# Altium schematic sheet 智能车主板.SchDoc
size A1
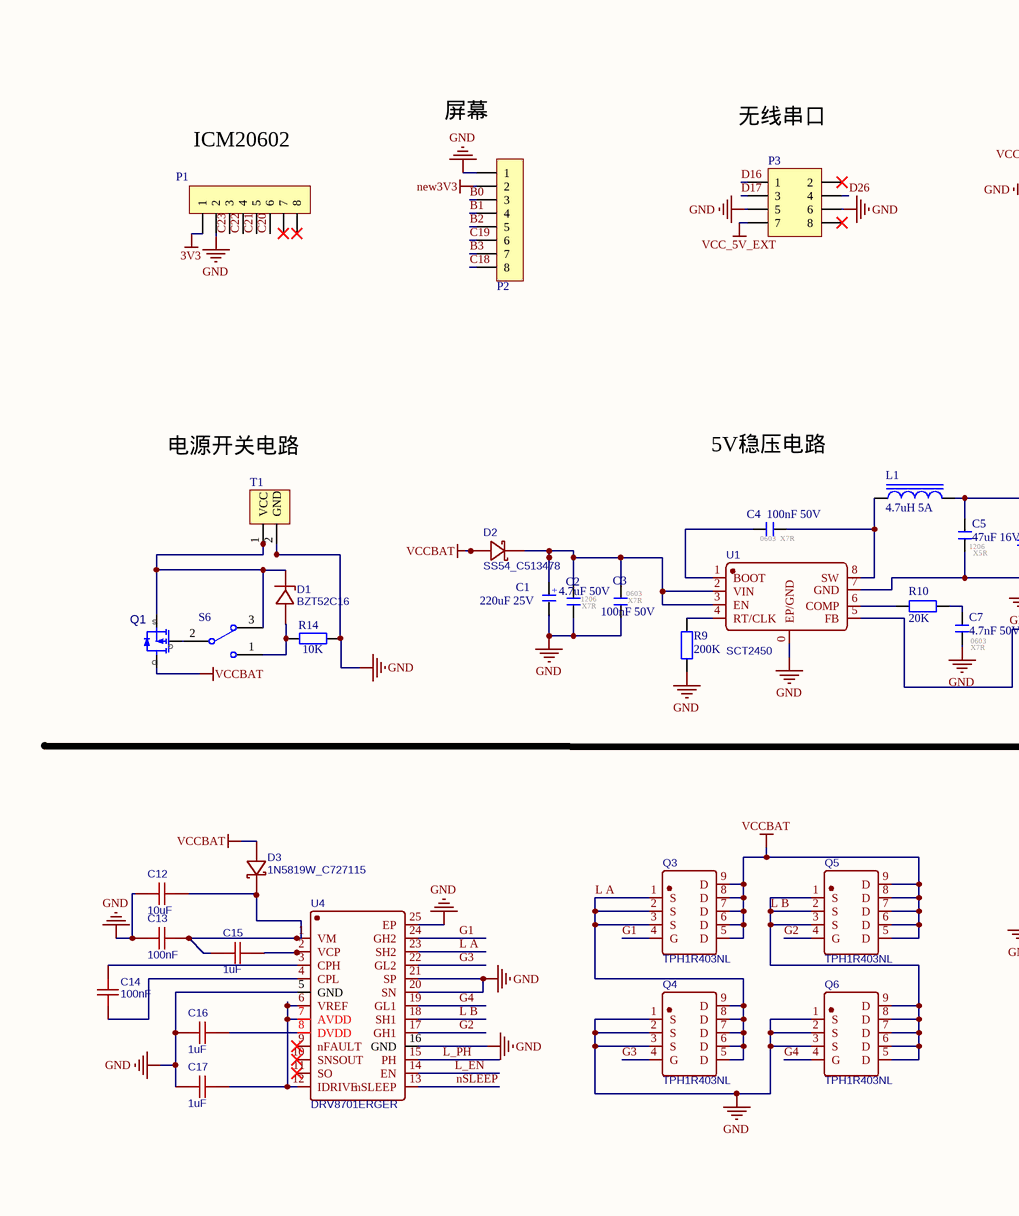
[diagram p0: 智能车主板.SchDoc, top left]
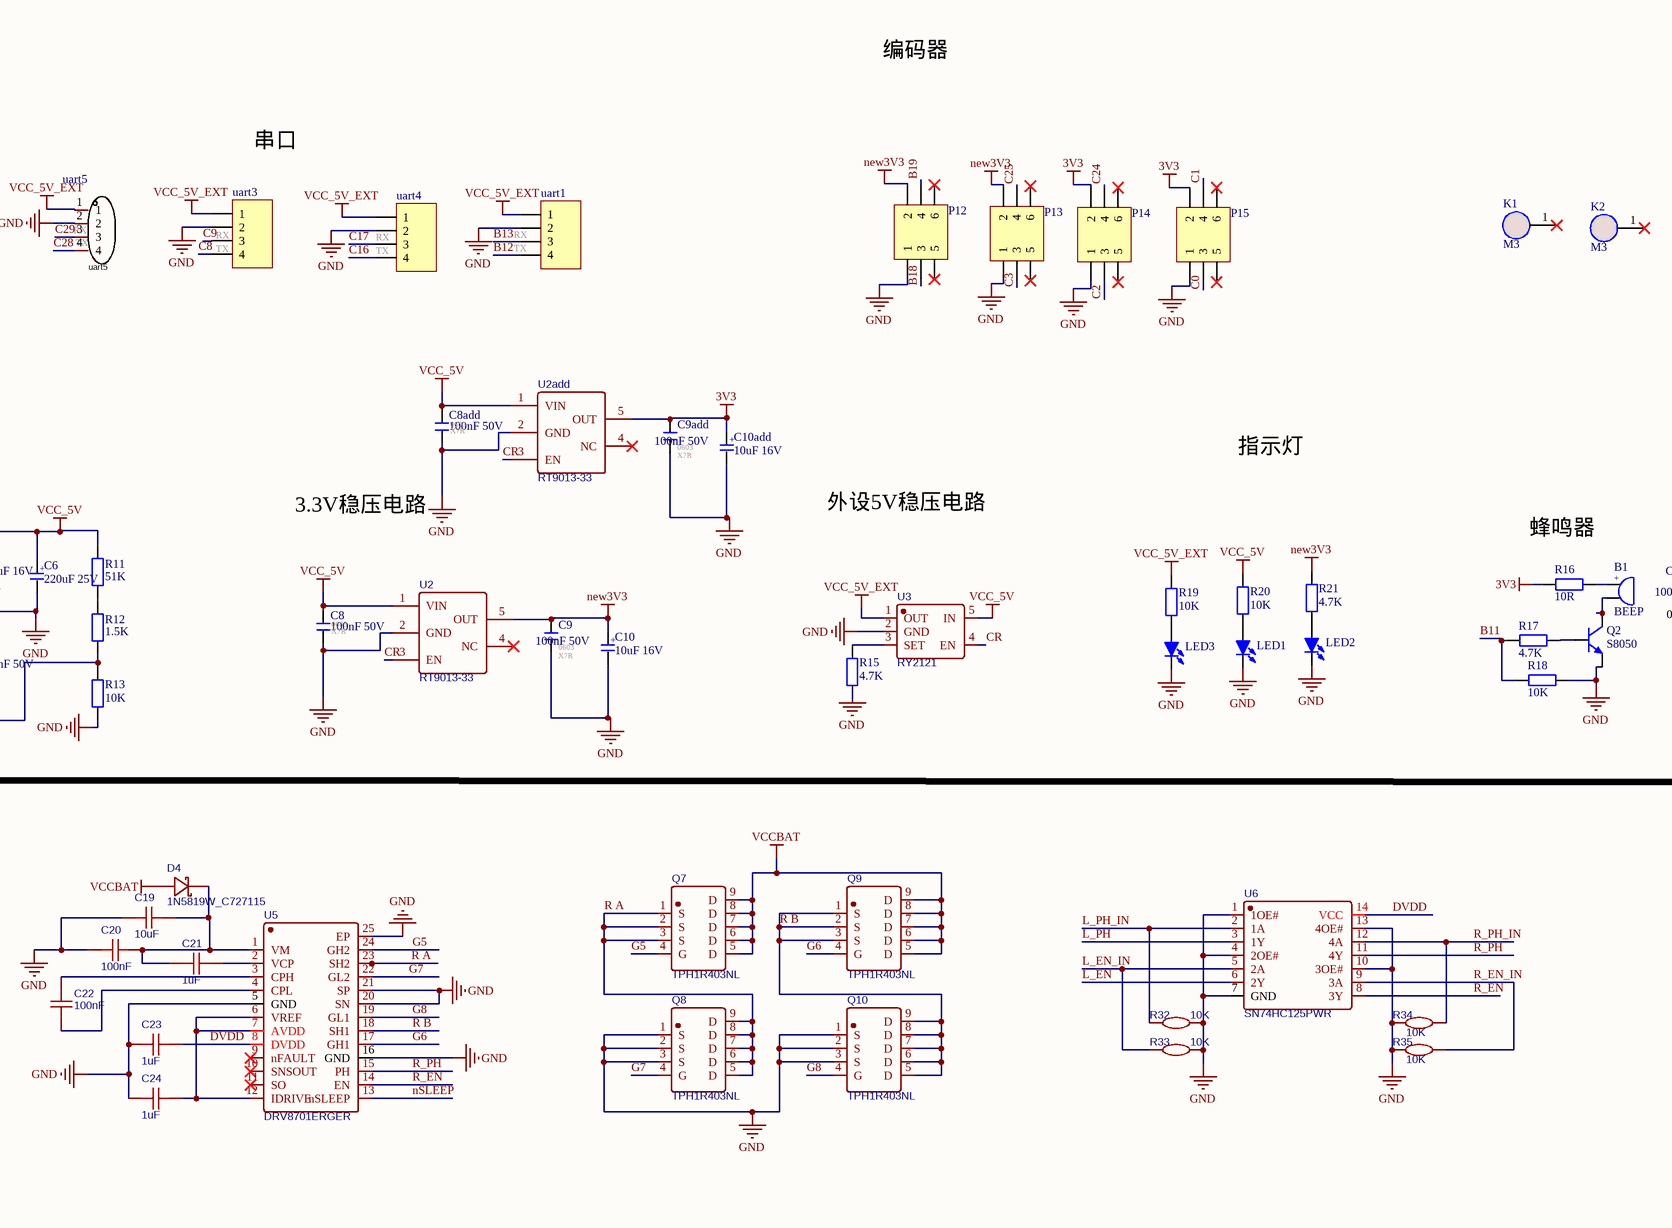
[diagram p1: 智能车主板.SchDoc, top middle]
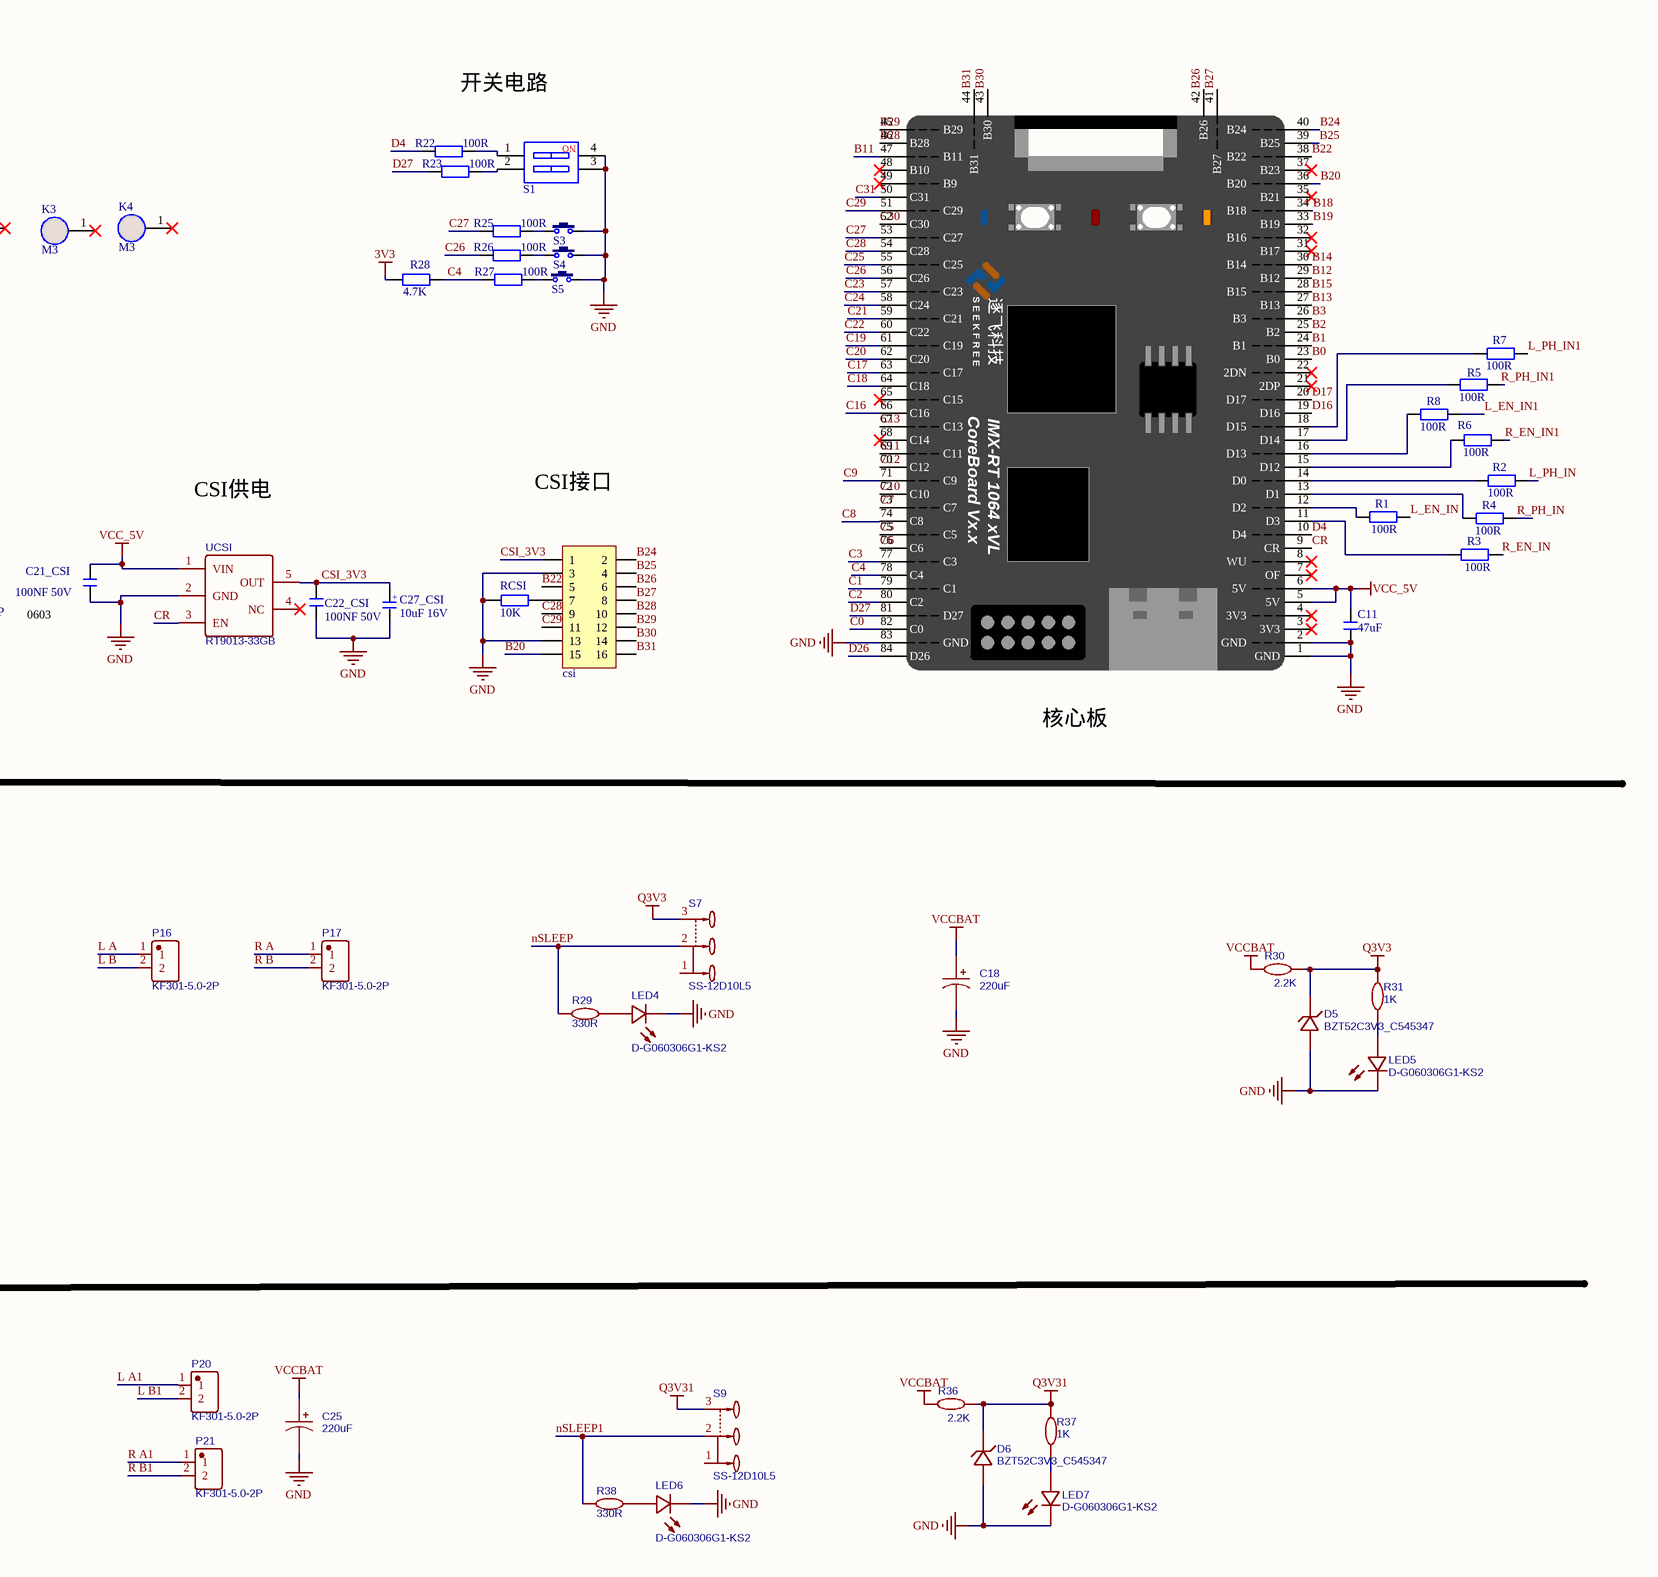
[diagram p2: 智能车主板.SchDoc, top right]
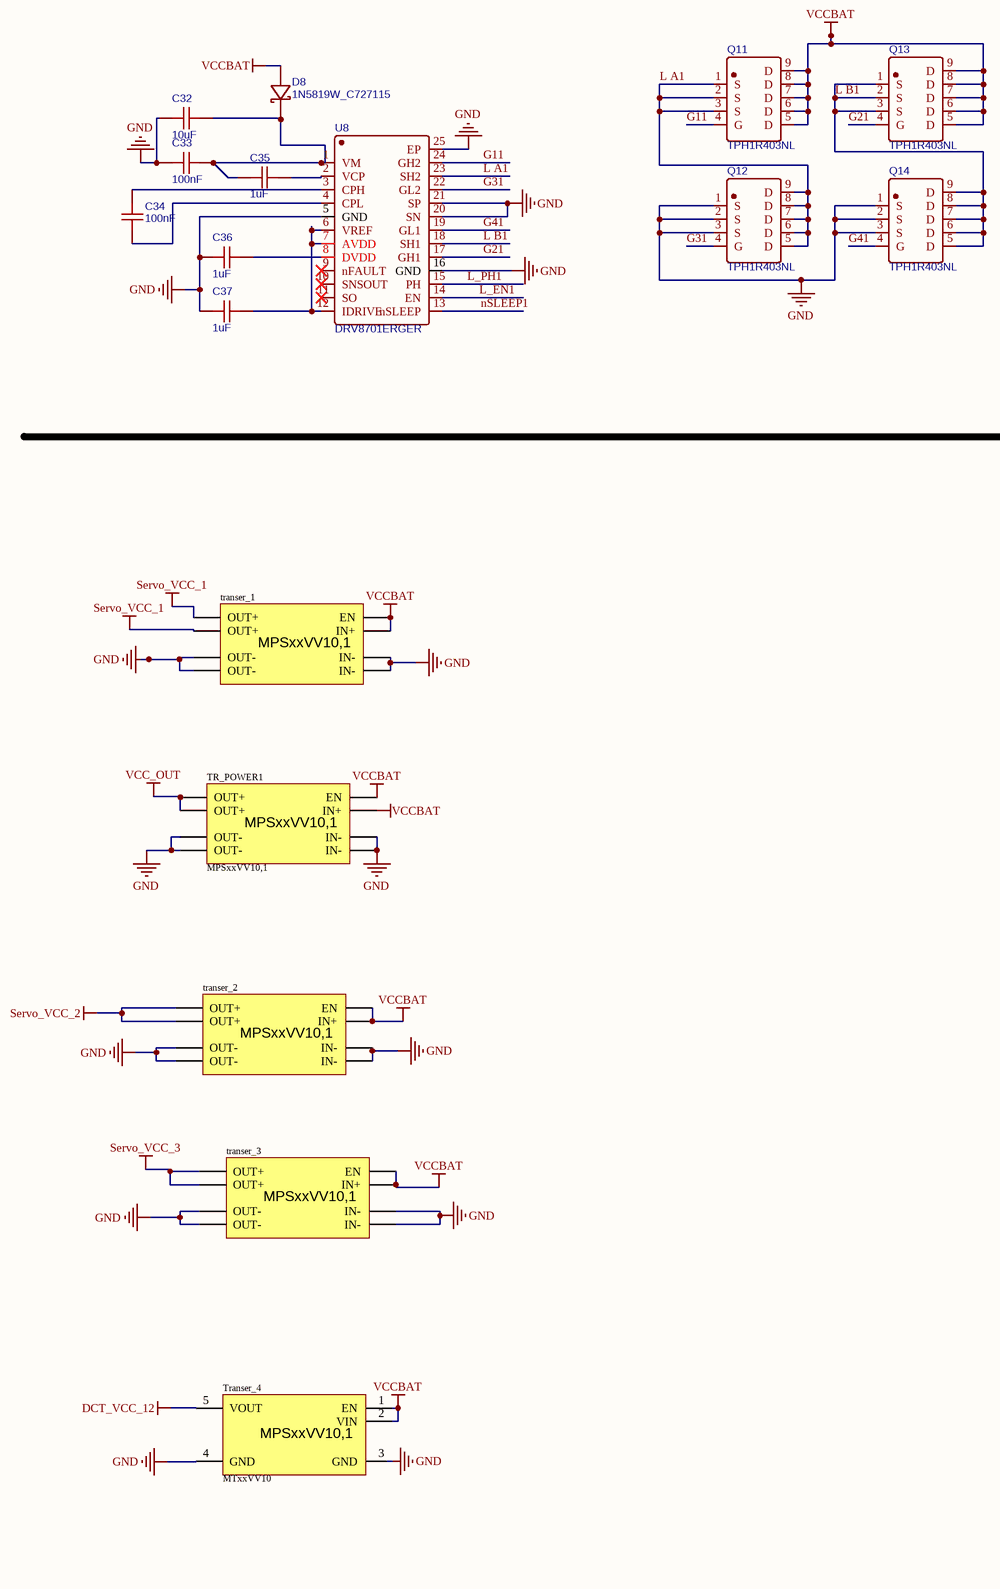
[diagram p3: 智能车主板.SchDoc, bottom left]
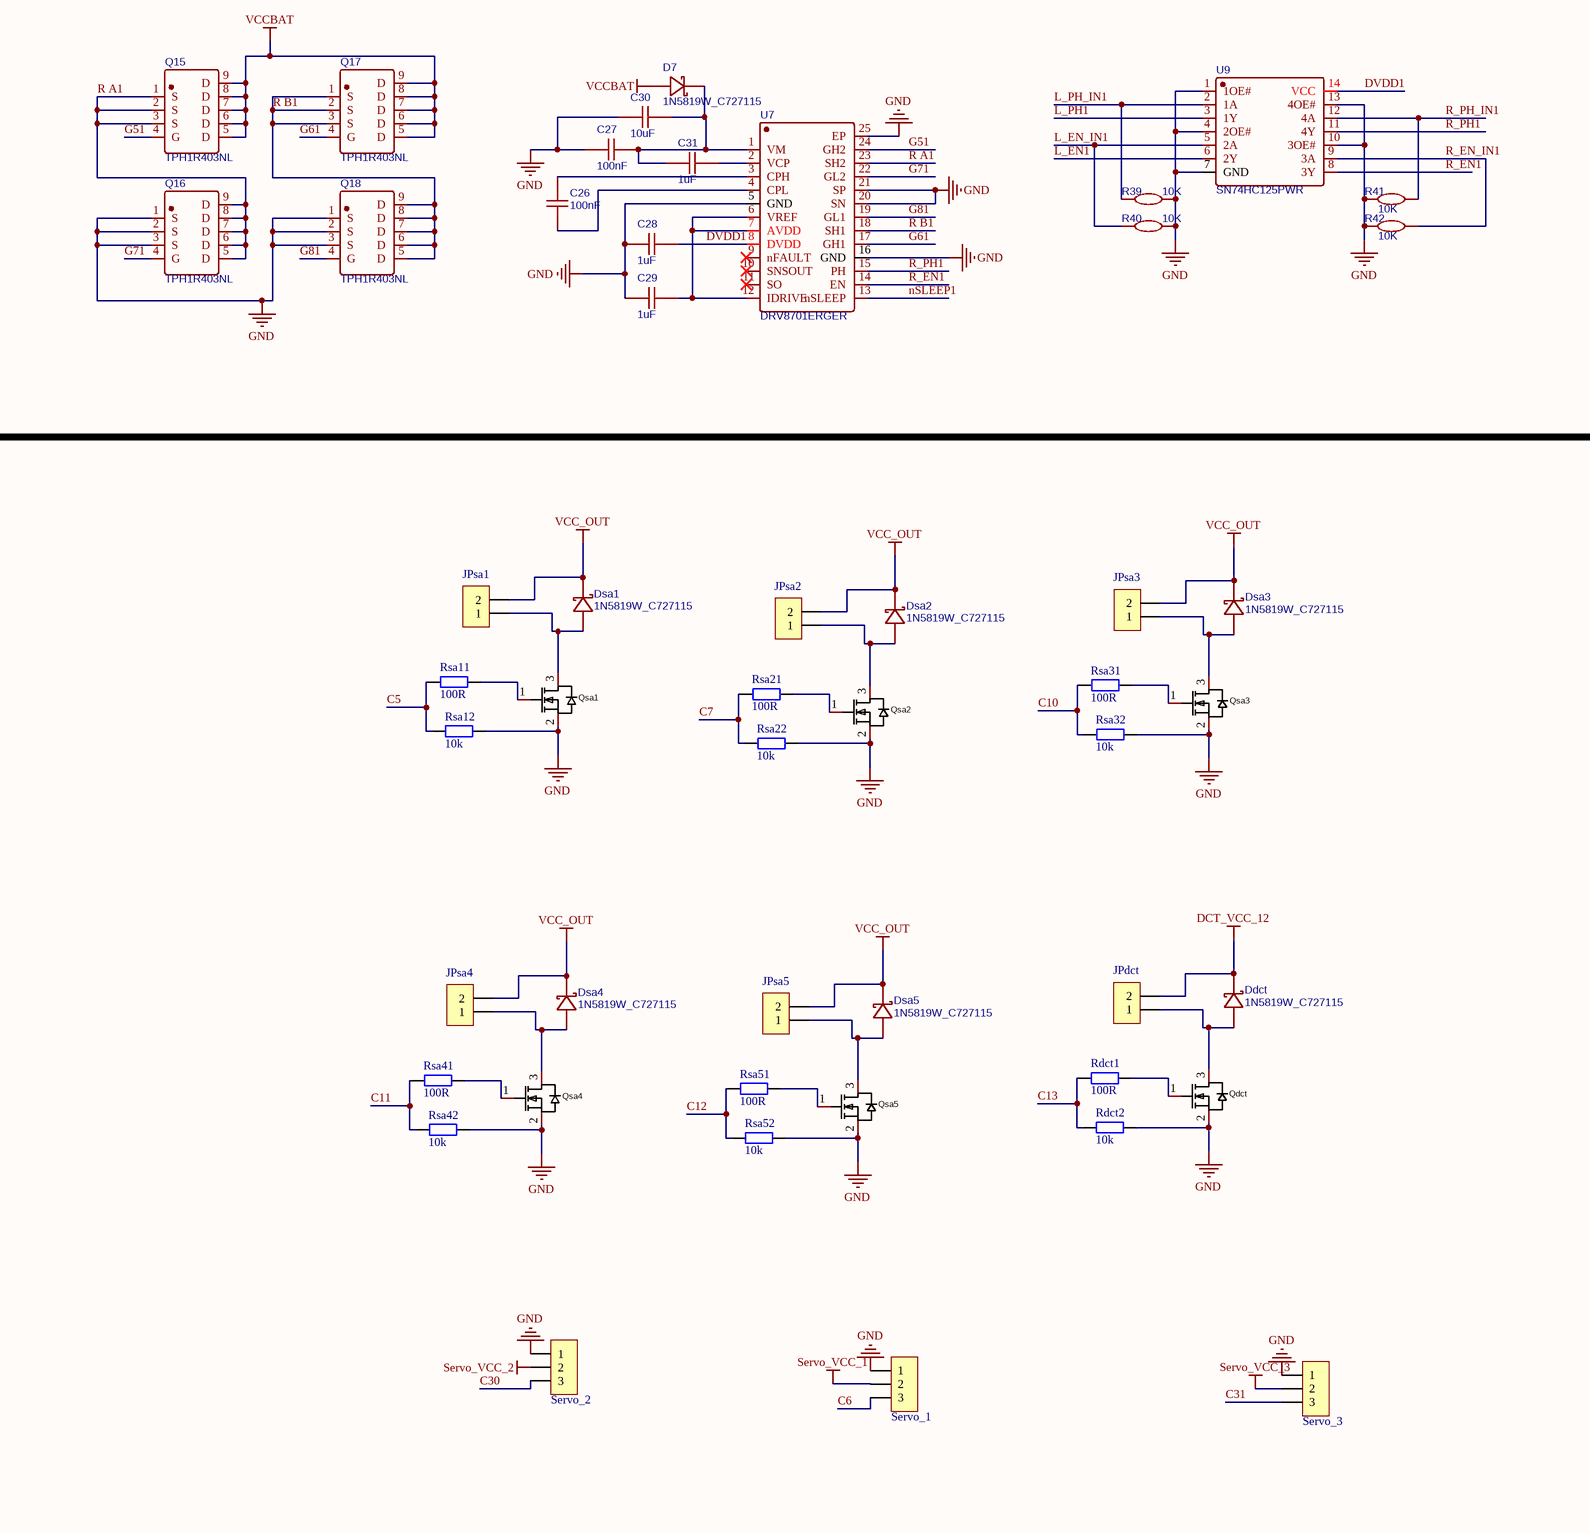
[diagram p4: 智能车主板.SchDoc, bottom middle]
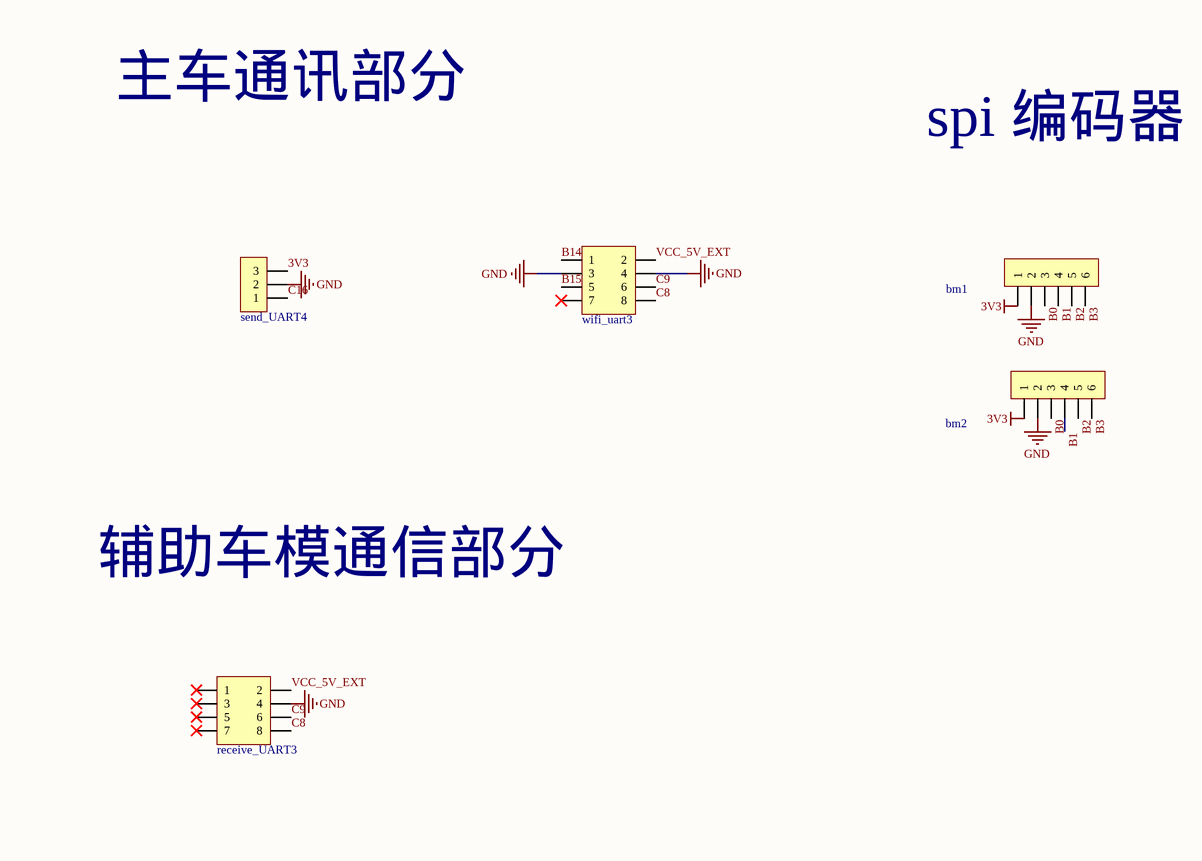
[diagram p5: 智能车主板.SchDoc, bottom right]

## Parts
B1  BEEP  [蜂鸣器]
bm1  HDR-1X6  [HDR1X6]  (value not drawn)
bm2  HDR-1X6  [HDR1X6]  (value not drawn)
C1  220uF 25V  [22uf25v贴片铝水解电容（6.3，7.7）]
C2  4.7uF 50V  [1206C]
C3  100nF 50V  [0603R]
C4  100nF 50V  [0603R]
C5  47uF 16V  [1206C]
C6  220uF 25V  [22uf25v贴片铝水解电容（6.3，7.7）]
C7  4.7nF 50V  [0603R]
C8  100nF 50V  [0603R]
C8add  100nF 50V  [0603R]
C9  100nF 50V  [0603R]
C9add  100nF 50V  [0603R]
C10  10uF 16V  [CASE-A-3216  钽电容]
C10add  10uF 16V  [CASE-A-3216  钽电容]
C11  47uF  [1206C]
C12  10uF  [0603R]
C13  100nF  [C0603]
C14  100nF  [C0603]
C15  1uF  [C0603]
C16  1uF  [C0603]
C17  1uF  [C0603]
C18  220uF  [22uf25v贴片铝水解电容（6.3，7.7）]
C19  10uF  [0603R]
C20  100nF  [C0603]
C21  1uF  [C0603]
C21_CSI  100NF 50V  [C0603]
C22  100nF  [C0603]
C22_CSI  100NF 50V  [C0603]
C23  1uF  [C0603]
C24  1uF  [C0603]
C25  220uF  [22uf25v贴片铝水解电容（6.3，7.7）]
C26  100nF  [C0603]
C27  100nF  [C0603]
C27_CSI  10uF 16V  [CASE-A-3216  钽电容]
C28  1uF  [C0603]
C29  1uF  [C0603]
C30  10uF  [0603R]
C31  1uF  [C0603]
C32  10uF  [0603R]
C33  100nF  [C0603]
C34  100nF  [C0603]
C35  1uF  [C0603]
C36  1uF  [C0603]
C37  1uF  [C0603]
csi  Header 8X2  [HDR2X8]  (value not drawn)
D1  BZT52C16  [SOD-123]
D2  SS54_C513478  [SMA（SS54）]
D3  1N5819W_C727115  [1N5819W_C727115]
D4  1N5819W_C727115  [1N5819W_C727115]
D5  BZT52C3V3_C545347  [SOD-123_L2.7-W1.6-LS3.7-RD]
D6  BZT52C3V3_C545347  [SOD-123_L2.7-W1.6-LS3.7-RD]
D7  1N5819W_C727115  [1N5819W_C727115]
D8  1N5819W_C727115  [1N5819W_C727115]
Ddct  1N5819W_C727115  [1N5819W_C727115]
Dsa1  1N5819W_C727115  [1N5819W_C727115]
Dsa2  1N5819W_C727115  [1N5819W_C727115]
Dsa3  1N5819W_C727115  [1N5819W_C727115]
Dsa4  1N5819W_C727115  [1N5819W_C727115]
Dsa5  1N5819W_C727115  [1N5819W_C727115]
JPdct  HDR-1X2  [HDR-2P]  (value not drawn)
JPsa1  HDR-1X2  [HDR-2P]  (value not drawn)
JPsa2  HDR-1X2  [HDR-2P]  (value not drawn)
JPsa3  HDR-1X2  [HDR-2P]  (value not drawn)
JPsa4  HDR-1X2  [HDR-2P]  (value not drawn)
JPsa5  HDR-1X2  [HDR-2P]  (value not drawn)
K1  M3  [固定孔M3]
K2  M3  [固定孔M3]
K3  M3  [固定孔M3]
K4  M3  [固定孔M3]
L1  4.7uH 5A  [功率电感SMD_L7.3-W6.6]
LED1  红色  [led 0603]  (value not drawn)
LED2  (no value)  [led 0603]
LED3  红色  [led 0603]  (value not drawn)
LED4  D-G060306G1-KS2  [LED0603-RD]
LED5  D-G060306G1-KS2  [LED0603-RD]
LED6  D-G060306G1-KS2  [LED0603-RD]
LED7  D-G060306G1-KS2  [LED0603-RD]
P1  HDR-1X8  [HDR1X8]  (value not drawn)
P2  HDR-1X8  [HDR1X8]  (value not drawn)
P3  Header 4X2  [HDR-2*4]  (value not drawn)
P12  编码器接口*4  [HDR2X3-SMT]  (value not drawn)
P13  编码器接口*4  [HDR2X3-SMT]  (value not drawn)
P14  编码器接口*4  [HDR2X3-SMT]  (value not drawn)
P15  编码器接口*4  [HDR2X3-SMT]  (value not drawn)
P16  KF301-5.0-2P  [端子]
P17  KF301-5.0-2P  [端子]
P20  KF301-5.0-2P  [端子]
P21  KF301-5.0-2P  [端子]
Q1  mos管  [TO-252AA]  (value not drawn)
Q2  S8050  [SOT-23（s8050三极管）]
Q3  TPH1R403NL  [DSOP-8_L5.0-W5.0-P1.27-EP-TL]
Q4  TPH1R403NL  [DSOP-8_L5.0-W5.0-P1.27-EP-TL]
Q5  TPH1R403NL  [DSOP-8_L5.0-W5.0-P1.27-EP-TL]
Q6  TPH1R403NL  [DSOP-8_L5.0-W5.0-P1.27-EP-TL]
Q7  TPH1R403NL  [DSOP-8_L5.0-W5.0-P1.27-EP-TL]
Q8  TPH1R403NL  [DSOP-8_L5.0-W5.0-P1.27-EP-TL]
Q9  TPH1R403NL  [DSOP-8_L5.0-W5.0-P1.27-EP-TL]
Q10  TPH1R403NL  [DSOP-8_L5.0-W5.0-P1.27-EP-TL]
Q11  TPH1R403NL  [DSOP-8_L5.0-W5.0-P1.27-EP-TL]
Q12  TPH1R403NL  [DSOP-8_L5.0-W5.0-P1.27-EP-TL]
Q13  TPH1R403NL  [DSOP-8_L5.0-W5.0-P1.27-EP-TL]
Q14  TPH1R403NL  [DSOP-8_L5.0-W5.0-P1.27-EP-TL]
Q15  TPH1R403NL  [DSOP-8_L5.0-W5.0-P1.27-EP-TL]
Q16  TPH1R403NL  [DSOP-8_L5.0-W5.0-P1.27-EP-TL]
Q17  TPH1R403NL  [DSOP-8_L5.0-W5.0-P1.27-EP-TL]
Q18  TPH1R403NL  [DSOP-8_L5.0-W5.0-P1.27-EP-TL]
Qdct  AO3402  [ao3402]  (value not drawn)
Qsa1  AO3402  [ao3402]  (value not drawn)
Qsa2  AO3402  [ao3402]  (value not drawn)
Qsa3  AO3402  [ao3402]  (value not drawn)
Qsa4  AO3402  [ao3402]  (value not drawn)
Qsa5  AO3402  [ao3402]  (value not drawn)
R1  100R  [0603R]
R2  100R  [0603R]
R3  100R  [0603R]
R4  100R  [0603R]
R5  100R  [0603R]
R6  100R  [0603R]
R7  100R  [0603R]
R8  100R  [0603R]
R9  200K  [0603R]
R10  20K  [0603R]
R11  51K  [0603R]
R12  1.5K  [0603R]
R13  10K  [0603R]
R14  10K  [0603R]
R15  4.7K  [0603R]
R16  10R  [0603R]
R17  4.7K  [0603R]
R18  10K  [0603R]
R19  10K  [0603R]
R20  10K  [0603R]
R21  4.7K  [0603R]
R22  100R  [0603R]
R23  100R  [0603R]
R25  100R  [0603R]
R26  100R  [0603R]
R27  100R  [0603R]
R28  4.7K  [0603R]
R29  330R  [R0603]
R30  2.2K  [R0603]
R31  1K  [R0603]
R32  10K  [0603R]
R33  10K  [0603R]
R34  10K  [0603R]
R35  10K  [0603R]
R36  2.2K  [R0603]
R37  1K  [R0603]
R38  330R  [R0603]
R39  10K  [0603R]
R40  10K  [0603R]
R41  10K  [0603R]
R42  10K  [0603R]
RCSI  10K  [C0603]
Rdct1  100R  [0603R]
Rdct2  10k  [C0603]
receive_UART3  Header 4X2  [HDR-2*4]  (value not drawn)
Rsa11  100R  [0603R]
Rsa12  10k  [C0603]
Rsa21  100R  [0603R]
Rsa22  10k  [C0603]
Rsa31  100R  [0603R]
Rsa32  10k  [C0603]
Rsa41  100R  [0603R]
Rsa42  10k  [C0603]
Rsa51  100R  [0603R]
Rsa52  10k  [C0603]
S1  编码开关  [拨码开关]  (value not drawn)
S3  6x6x5  [轻触开关]  (value not drawn)
S4  6x6x5  [轻触开关]  (value not drawn)
S5  6x6x5  [轻触开关]  (value not drawn)
S6  单刀双置开关  [逐飞黑开关]  (value not drawn)
S7  SS-12D10L5  [逐飞黑开关]
S9  SS-12D10L5  [逐飞黑开关]
send_UART4  HDR-1X3  [HDR1X3]  (value not drawn)
Servo_1  HDR-1X3  [HDR1X3]  (value not drawn)
Servo_2  HDR-1X3  [HDR1X3]  (value not drawn)
Servo_3  HDR-1X3  [HDR1X3]  (value not drawn)
T1  T型插头  [T插头]  (value not drawn)
TR_POWER1  MPSxxVV10,1  [MPSxxVV10,1模块贴片封装]
transer_1  MPSxxVV10,1  [MPSxxVV10,1模块贴片封装]  (value not drawn)
transer_2  MPSxxVV10,1  [MPSxxVV10,1模块贴片封装]  (value not drawn)
transer_3  MPSxxVV10,1  [MPSxxVV10,1模块贴片封装]  (value not drawn)
Transer_4  MTxxVV10  [MTxxVV10模块贴片封装]
U1  SCT2450  [SOP-8E]
U2  RT9013-33  [SOT-23-5（rt9013-33）]
U2add  RT9013-33  [SOT-23-5（rt9013-33）]
U3  RY2121  [SOT-23-5（rt9013-33）]
U4  DRV8701ERGER  [VQFN-24_L4.0-W4.0-P0.50-BL-EP2.8]
U5  DRV8701ERGER  [VQFN-24_L4.0-W4.0-P0.50-BL-EP2.8]
U6  SN74HC125PWR  [TSSOP-14_L5.0-W4.4-P0.65-LS6.5-BL]
U7  DRV8701ERGER  [VQFN-24_L4.0-W4.0-P0.50-BL-EP2.8]
U8  DRV8701ERGER  [VQFN-24_L4.0-W4.0-P0.50-BL-EP2.8]
U9  SN74HC125PWR  [TSSOP-14_L5.0-W4.4-P0.65-LS6.5-BL]
U10  RT1064 核心板  [核心板]  (value not drawn)
uart1  Header 4  [HDR1X4]  (value not drawn)
uart3  Header 4  [HDR1X4]  (value not drawn)
uart4  Header 4  [HDR1X4]  (value not drawn)
uart5  uart5  [HDR1X4]
UCSI  RT9013-33GB  [SOT-23-5（rt9013-33）]
wifi_uart3  Header 4X2  [HDR-2*4]  (value not drawn)

## Nets
3V3: bm1.1 bm2.1 C9add.2 C10add.1(A) P1.1 P14.2 P15.2 R16.1 R28.2 send_UART4.3 U2add.5(OUT)
DCT_VCC_12: Ddct.1(C) JPdct.2 Transer_4.5(VOUT)
GND: bm1.2 bm2.2 C1.2(K) C2.1 C3.1 C5.1 C6.2(K) C7.1 C8.1 C8add.1 C9.1 C9add.1 C10.2(K) C10add.2(K) C11.1 C12.1 C13.1 C16.1 C17.1 C18.2 C19.1 C20.1 C21_CSI.1 C22_CSI.1 C23.1 C24.1 C25.2 C27.1 C27_CSI.2(K) C28.1 C29.1 C30.1 C32.1 C33.1 C36.1 C37.1 csi.3 csi.13 D5.2(A) D6.2(A) LED1.2(K) LED2.2(K) LED3.2(K) LED4.1(-) LED5.1(-) LED6.1(-) LED7.1(-) P1.2 P2.1 P3.5 P3.6 P12.1 P13.1 P14.1 P15.1 Q2.2(E) Q4.1(S) Q4.2(S) Q4.3(S) Q6.1(S) Q6.2(S) Q6.3(S) Q8.1(S) Q8.2(S) Q8.3(S) Q10.1(S) Q10.2(S) Q10.3(S) Q12.1(S) Q12.2(S) Q12.3(S) Q14.1(S) Q14.2(S) Q14.3(S) Q16.1(S) Q16.2(S) Q16.3(S) Q18.1(S) Q18.2(S) Q18.3(S) Qdct.2(S) Qsa1.2(S) Qsa2.2(S) Qsa3.2(S) Qsa4.2(S) Qsa5.2(S) R9.2 R13.2 R14.2 R15.2 R18.2 R32.2 R33.2 R34.1 R35.1 R39.2 R40.2 R41.1 R42.1 RCSI.1 Rdct2.2 receive_UART3.4 Rsa12.2 Rsa22.2 Rsa32.2 Rsa42.2 Rsa52.2 S1.3 S1.4 S3.2 S4.2 S5.2 send_UART4.2 Servo_1.1 Servo_2.1 Servo_3.1 T1.2(GND) TR_POWER1.3(OUT-) TR_POWER1.4(OUT-) TR_POWER1.5(IN-) TR_POWER1.6(IN-) transer_1.3(OUT-) transer_1.4(OUT-) transer_1.5(IN-) transer_1.6(IN-) transer_2.3(OUT-) transer_2.4(OUT-) transer_2.5(IN-) transer_2.6(IN-) transer_3.3(OUT-) transer_3.4(OUT-) transer_3.5(IN-) transer_3.6(IN-) Transer_4.3(GND) Transer_4.4(GND) U1.0(EP/GND) U1.7(GND) U2.2(GND) U2add.2(GND) U3.2(GND) U4.5(GND) U4.16(GND) U4.20(SN) U4.21(SP) U4.25(EP) U5.5(GND) U5.16(GND) U5.20(SN) U5.21(SP) U5.25(EP) U6.1(1OE#) U6.4(2OE#) U6.7(GND) U6.10(3OE#) U6.13(4OE#) U7.5(GND) U7.16(GND) U7.20(SN) U7.21(SP) U7.25(EP) U8.5(GND) U8.16(GND) U8.20(SN) U8.21(SP) U8.25(EP) U9.1(1OE#) U9.4(2OE#) U9.7(GND) U9.10(3OE#) U9.13(4OE#) U10.1(GND) U10.2(GND) U10.83(GND) uart1.2 uart3.2 uart4.2 uart5.2 UCSI.2(GND) wifi_uart3.3 wifi_uart3.4
new3V3: C9.2 C10.1(A) P2.2 P12.2 P13.2 R21.2 U2.5(OUT)
Q3V3: D5.1(C) R30.2 R31.2 S7.3
Q3V31: D6.1(C) R36.2 R37.2 S9.3
Servo_VCC_1: Servo_1.2 transer_1.1(OUT+) transer_1.2(OUT+)
Servo_VCC_2: Servo_2.2 transer_2.1(OUT+) transer_2.2(OUT+)
Servo_VCC_3: Servo_3.2 transer_3.1(OUT+) transer_3.2(OUT+)
VCC_5V: C5.2 C6.1(A) C8.2 C8add.2 C11.2 C21_CSI.2 L1.2 R11.1 R20.2 U2.1(VIN) U2add.1(VIN) U3.5(IN) U10.5(5V) U10.6(5V) UCSI.1(VIN)
VCC_5V_EXT: P3.7 R19.2 receive_UART3.2 U3.1(OUT) uart1.1 uart3.1 uart4.1 uart5.1 wifi_uart3.2
VCC_OUT: Dsa1.1(C) Dsa2.1(C) Dsa3.1(C) Dsa4.1(C) Dsa5.1(C) JPsa1.2 JPsa2.2 JPsa3.2 JPsa4.2 JPsa5.2 TR_POWER1.1(OUT+) TR_POWER1.2(OUT+)
VCCBAT: C18.1 C25.1 D2.A D3.2(A) D4.2(A) D7.2(A) D8.2(A) Q1.1(D) Q3.5(D) Q3.6(D) Q3.7(D) Q3.8(D) Q3.9(D) Q5.5(D) Q5.6(D) Q5.7(D) Q5.8(D) Q5.9(D) Q7.5(D) Q7.6(D) Q7.7(D) Q7.8(D) Q7.9(D) Q9.5(D) Q9.6(D) Q9.7(D) Q9.8(D) Q9.9(D) Q11.5(D) Q11.6(D) Q11.7(D) Q11.8(D) Q11.9(D) Q13.5(D) Q13.6(D) Q13.7(D) Q13.8(D) Q13.9(D) Q15.5(D) Q15.6(D) Q15.7(D) Q15.8(D) Q15.9(D) Q17.5(D) Q17.6(D) Q17.7(D) Q17.8(D) Q17.9(D) R30.1 R36.1 TR_POWER1.7(IN+) TR_POWER1.8(EN) transer_1.7(IN+) transer_1.8(EN) transer_2.7(IN+) transer_2.8(EN) transer_3.7(IN+) transer_3.8(EN) Transer_4.1(EN) Transer_4.2(VIN)
B0: bm1.3 bm2.3 P2.3 U10.23(B0)
B1: bm1.4 bm2.4 P2.4 U10.24(B1)
B2: bm1.5 bm2.5 P2.5 U10.25(B2)
B3: bm1.6 bm2.6 P2.7 U10.26(B3)
B11: R17.1 R18.1 U10.47(B11)
B12: U10.29(B12) uart1.4
B13: U10.27(B13) uart1.3
B14: U10.30(B14) wifi_uart3.1
B15: U10.28(B15) wifi_uart3.5
B18: P12.3 U10.34(B18)
B19: P12.4 U10.33(B19)
B20: csi.15 U10.36(B20)
B22: csi.5 U10.38(B22)
B24: csi.2 U10.40(B24)
B25: csi.4 U10.39(B25)
B26: csi.6 U10.42(B26)
B27: csi.8 U10.41(B27)
B28: csi.10 U10.46(B28)
B29: csi.12 U10.45(B29)
B30: csi.14 U10.43(B30)
B31: csi.16 U10.44(B31)
C0: P15.3 U10.82(C0)
C1: P15.4 U10.79(C1)
C2: P14.3 U10.80(C2)
C3: P13.3 U10.77(C3)
C4: R27.2 R28.1 U10.78(C4)
C5: Rsa11.1 Rsa12.1 U10.75(C5)
C6: Servo_1.3 U10.76(C6)
C7: Rsa21.1 Rsa22.1 U10.73(C7)
C8: receive_UART3.8 U10.74(C8) uart3.4 wifi_uart3.8
C9: receive_UART3.6 U10.71(C9) uart3.3 wifi_uart3.6
C10: Rsa31.1 Rsa32.1 U10.72(C10)
C11: Rsa41.1 Rsa42.1 U10.69(C11)
C12: Rsa51.1 Rsa52.1 U10.70(C12)
C13: Rdct1.1 Rdct2.1 U10.67(C13)
C16: send_UART4.1 U10.66(C16) uart4.4
C17: U10.63(C17) uart4.3
C18: P2.8 U10.64(C18)
C19: P2.6 U10.61(C19)
C20: P1.6 U10.62(C20)
C21: P1.5 U10.59(C21)
C22: P1.4 U10.60(C22)
C23: P1.3 U10.57(C23)
C24: P14.4 U10.58(C24)
C25: P13.4 U10.55(C25)
C26: R26.2 U10.56(C26)
C27: R25.2 U10.53(C27)
C28: csi.9 U10.54(C28) uart5.4
C29: csi.11 U10.51(C29) uart5.3
C30: Servo_2.3 U10.52(C30)
C31: Servo_3.3 U10.50(C31)
CR: U2.3(EN) U2add.3(EN) U3.4(EN) U10.9(CR) UCSI.3(EN)
CSI_3V3: C22_CSI.2 C27_CSI.1(A) csi.1 UCSI.5(OUT)
D4: R22.2 U10.10(D4)
D16: P3.1 U10.19(D16)
D17: P3.3 U10.20(D17)
D26: P3.4 U10.84(D26)
D27: R23.2 U10.81(D27)
DVDD: C23.2 U5.8(DVDD) U6.14(VCC)
DVDD1: C28.2 U7.8(DVDD) U9.14(VCC)
G1: Q3.4(G) U4.24(GH2)
G2: Q5.4(G) U4.17(GH1)
G3: Q4.4(G) U4.22(GL2)
G4: Q6.4(G) U4.19(GL1)
G5: Q7.4(G) U5.24(GH2)
G6: Q9.4(G) U5.17(GH1)
G7: Q8.4(G) U5.22(GL2)
G8: Q10.4(G) U5.19(GL1)
G11: Q11.4(G) U8.24(GH2)
G21: Q13.4(G) U8.17(GH1)
G31: Q12.4(G) U8.22(GL2)
G41: Q14.4(G) U8.19(GL1)
G51: Q15.4(G) U7.24(GH2)
G61: Q17.4(G) U7.17(GH1)
G71: Q16.4(G) U7.22(GL2)
G81: Q18.4(G) U7.19(GL1)
L A: P16.1 Q3.1(S) Q3.2(S) Q3.3(S) Q4.5(D) Q4.6(D) Q4.7(D) Q4.8(D) Q4.9(D) U4.23(SH2)
L A1: P20.1 Q11.1(S) Q11.2(S) Q11.3(S) Q12.5(D) Q12.6(D) Q12.7(D) Q12.8(D) Q12.9(D) U8.23(SH2)
L B: P16.2 Q5.1(S) Q5.2(S) Q5.3(S) Q6.5(D) Q6.6(D) Q6.7(D) Q6.8(D) Q6.9(D) U4.18(SH1)
L B1: P20.2 Q13.1(S) Q13.2(S) Q13.3(S) Q14.5(D) Q14.6(D) Q14.7(D) Q14.8(D) Q14.9(D) U8.18(SH1)
L_EN: U4.14(EN) U6.6(2Y)
L_EN1: U8.14(EN) U9.6(2Y)
L_EN_IN: R1.2 R33.1 U6.5(2A)
L_EN_IN1: R8.2 R40.1 U9.5(2A)
L_PH: U4.15(PH) U6.3(1Y)
L_PH1: U8.15(PH) U9.3(1Y)
L_PH_IN: R2.2 R32.1 U6.2(1A)
L_PH_IN1: R7.2 R39.1 U9.2(1A)
nSLEEP: R29.1 S7.2 U4.13(nSLEEP) U5.13(nSLEEP)
nSLEEP1: R38.1 S9.2 U7.13(nSLEEP) U8.13(nSLEEP)
R A: P17.1 Q7.1(S) Q7.2(S) Q7.3(S) Q8.5(D) Q8.6(D) Q8.7(D) Q8.8(D) Q8.9(D) U5.23(SH2)
R A1: P21.1 Q15.1(S) Q15.2(S) Q15.3(S) Q16.5(D) Q16.6(D) Q16.7(D) Q16.8(D) Q16.9(D) U7.23(SH2)
R B: P17.2 Q9.1(S) Q9.2(S) Q9.3(S) Q10.5(D) Q10.6(D) Q10.7(D) Q10.8(D) Q10.9(D) U5.18(SH1)
R B1: P21.2 Q17.1(S) Q17.2(S) Q17.3(S) Q18.5(D) Q18.6(D) Q18.7(D) Q18.8(D) Q18.9(D) U7.18(SH1)
R_EN: U5.14(EN) U6.8(3Y)
R_EN1: U7.14(EN) U9.8(3Y)
R_EN_IN: R3.2 R35.2 U6.9(3A)
R_EN_IN1: R6.2 R42.2 U9.9(3A)
R_PH: U5.15(PH) U6.11(4Y)
R_PH1: U7.15(PH) U9.11(4Y)
R_PH_IN: R4.2 R34.2 U6.12(4A)
R_PH_IN1: R5.2 R41.2 U9.12(4A)
NetB1_1: B1.1 R16.2
NetB1_2: B1.2 Q2.3(C)
NetC1_1: C1.1(A) C2.2 C3.2 D2.K U1.2(VIN) U1.3(EN)
NetC4_1: C4.1 L1.1 U1.8(SW)
NetC4_2: C4.2 U1.1(BOOT)
NetC7_2: C7.2 R10.2
NetC12_2: C12.2 C13.2 C15.1 D3.1(C) U4.1(VM)
NetC14_1: C14.1 U4.4(CPL)
NetC14_2: C14.2 U4.3(CPH)
NetC15_2: C15.2 U4.2(VCP)
NetC16_2: C16.2 U4.8(DVDD)
NetC17_2: C17.2 U4.6(VREF) U4.7(AVDD) U4.12(IDRIVE)
NetC19_2: C19.2 C20.2 C21.1 D4.1(C) U5.1(VM)
NetC21_2: C21.2 U5.2(VCP)
NetC22_1: C22.1 U5.4(CPL)
NetC22_2: C22.2 U5.3(CPH)
NetC24_2: C24.2 U5.6(VREF) U5.7(AVDD) U5.12(IDRIVE)
NetC26_1: C26.1 U7.4(CPL)
NetC26_2: C26.2 U7.3(CPH)
NetC27_2: C27.2 C30.2 C31.1 D7.1(C) U7.1(VM)
NetC29_2: C29.2 U7.6(VREF) U7.7(AVDD) U7.12(IDRIVE)
NetC31_2: C31.2 U7.2(VCP)
NetC32_2: C32.2 C33.2 C35.1 D8.1(C) U8.1(VM)
NetC34_1: C34.1 U8.4(CPL)
NetC34_2: C34.2 U8.3(CPH)
NetC35_2: C35.2 U8.2(VCP)
NetC36_2: C36.2 U8.8(DVDD)
NetC37_2: C37.2 U8.6(VREF) U8.7(AVDD) U8.12(IDRIVE)
Netcsi_7: csi.7 RCSI.2
NetD1_A: D1.A R14.1 S6.1
NetD1_K: D1.K Q1.3(S) S6.3 T1.1(VCC)
NetDdct_2: Ddct.2(A) JPdct.1 Qdct.3(D)
NetDsa1_2: Dsa1.2(A) JPsa1.1 Qsa1.3(D)
NetDsa2_2: Dsa2.2(A) JPsa2.1 Qsa2.3(D)
NetDsa3_2: Dsa3.2(A) JPsa3.1 Qsa3.3(D)
NetDsa4_2: Dsa4.2(A) JPsa4.1 Qsa4.3(D)
NetDsa5_2: Dsa5.2(A) JPsa5.1 Qsa5.3(D)
NetLED1_1: LED1.1(A) R20.1
NetLED2_1: LED2.1(A) R21.1
NetLED3_1: LED3.1(A) R19.1
NetLED4_2: LED4.2(+) R29.2
NetLED5_2: LED5.2(+) R31.1
NetLED6_2: LED6.2(+) R38.2
NetLED7_2: LED7.2(+) R37.1
NetQ1_2: Q1.2(G) S6.2
NetQ2_1: Q2.1(B) R17.2
NetQdct_1: Qdct.1(G) Rdct1.2
NetQsa1_1: Qsa1.1(G) Rsa11.2
NetQsa2_1: Qsa2.1(G) Rsa21.2
NetQsa3_1: Qsa3.1(G) Rsa31.2
NetQsa4_1: Qsa4.1(G) Rsa41.2
NetQsa5_1: Qsa5.1(G) Rsa51.2
NetR1_1: R1.1 U10.12(D2)
NetR2_1: R2.1 U10.14(D0)
NetR3_1: R3.1 U10.11(D3)
NetR4_1: R4.1 U10.13(D1)
NetR5_1: R5.1 U10.17(D14)
NetR6_1: R6.1 U10.15(D12)
NetR7_1: R7.1 U10.18(D15)
NetR8_1: R8.1 U10.16(D13)
NetR9_1: R9.1 U1.4(RT/CLK)
NetR10_1: R10.1 U1.6(COMP)
NetR11_2: R11.2 R12.1
NetR12_2: R12.2 R13.1 U1.5(FB)
NetR15_1: R15.1 U3.3(SET)
NetR22_1: R22.1 S1.1
NetR23_1: R23.1 S1.2
NetR25_1: R25.1 S3.1
NetR26_1: R26.1 S4.1
NetR27_1: R27.1 S5.1

Not connected (* = marked no-connect by the designer): K1 1(3)*; K2 1(3)*; K3 1(3)*; K4 1(3)*; P1 7* 8*; P3 2* 8*; P12 5* 6*; P13 5* 6*; P14 5* 6*; P15 5* 6*; receive_UART3 1* 3* 5* 7*; S7 1; S9 1; U2 4(NC)*; U2add 4(NC)*; U4 9(nFAULT)* 10(SNSOUT)* 11(SO)*; U5 9(nFAULT)* 10(SNSOUT)* 11(SO)*; U7 9(nFAULT)* 10(SNSOUT)* 11(SO)*; U8 9(nFAULT)* 10(SNSOUT)* 11(SO)*; U10 3(3V3)* 4(3V3)* 7(OF)* 8(WU)* 21(2DP)* 22(2DN)* 31(B17)* 32(B16)* 35(B21)* 37(B23)* 48(B10)* 49(B9)* 65(C15)* 68(C14)*; UCSI 4(NC)*; wifi_uart3 7*

## Notes on the sheet
- 编码器
- (near P2) 屏幕
- 串口
- 开关电路
- ICM20602
- (near P3) 无线串口
- (near uart5) RX
- (near uart5) TX
- (near uart3) RX
- (near uart3) TX
- (near uart4) RX
- (near uart4) TX
- (near uart1) RX
- (near uart1) TX
- (near C8add) 0603
- 电源开关电路
- (near L1) 5V稳压电路
- (near C8add) X7R
- (near C9add) 0603
- (near C9add) X7R
- 指示灯
- CSI接口
- 3.3V稳压电路
- 外设5V稳压电路
- 蜂鸣器
- CSI供电
- (near C3) 0603
- (near C4) 0603
- (near C4) X7R
- (near C5) 1206
- (near C5) X5R
- (near C8) 0603
- (near C8) X7R
- 0603 X7R
- (near S6) S6
- (near C2) 1206
- (near C2) X7R
- (near C3) X7R
- (near C7) 0603
- (near C7) X7R
- (near C9) 0603
- (near C9) X7R
- (near U10) 核心板
- 主车通讯部分
- spi 编码器
- 辅助车模通信部分
- (in symbol BEEP) +
- (in symbol MIMXRT1064xVL_CoreBoard) S E E K F R E E; 逐飞科技; CoreBoard Vx.x; IMX-RT 1064 xVL
- (in symbol MTxxVV10) MPSxxVV10,1
- (in symbol 带+电容) +
- (in symbol 编码开关) NO

## Library data of the parts
B1 = BEEP: 蜂鸣器; 版权归属: 源创客; BOM名称: 蜂鸣器; 学习资源: www.ooocke.com
bm1 bm2 = Header 6: 6P接插件; 版权归属: 封装库来自淘宝 ID：黄晶宝石; BOM名称: 6P接插件; 学习资源: https://shop463601444.taobao.com
C1 C6 C27_CSI = 带+电容: 贴片钽电容; 淘宝ID: 封装库来自淘宝 ID：黄晶宝石; BOM名称: 贴片钽电容; 联系售后: https://shop463601444.taobao.com
C2-C5 C7 C8 C8add C9 C9add C11 C21_CSI C22_CSI = C: 无极性贴片电容; 版权归属: 源创客; 材质: X7R; BOM名称: 无极性贴片电容; 学习资源: www.ooocke.com
C10 C10add = 带+电容: 贴片钽电容 T494B106K016AT; 淘宝ID: 封装库来自淘宝 ID：黄晶宝石; BOM名称: 贴片钽电容; 联系售后: https://shop463601444.taobao.com
C12 C19 C30 C32 = 10uF_1: BOM_Manufacturer: SAMSUNG; BOM_Manufacturer Part: CL21B106KOQNNNE; nameAlias: Capacitance; BOM_Supplier: LCSC; BOM_Supplier Part: C95841; BOM_JLCPCB Part Class: Extended Part; spicePre: C; spiceSymbolName: CL21B106KOQNNNE
C13-C17 C20-C24 C26-C29 C31 C33-C37 = 100nF: BOM_Manufacturer: YAGEO; BOM_Manufacturer Part: CC0603KRX7R9BB104; nameAlias: Capacitance; BOM_Supplier: LCSC; BOM_Supplier Part: C14663; BOM_JLCPCB Part Class: Basic Part; spicePre: C; spiceSymbolName: CC0603KRX7R9BB104
C18 C25 = 100uF: BOM_Manufacturer: Ymin; BOM_Manufacturer Part: VPXC0581E101MVTM; nameAlias: Capacitance; Contributor: LCSC; BOM_Supplier: LCSC; BOM_Supplier Part: C480063; BOM_JLCPCB Part Class: Extended Part; spicePre: C; spiceSymbolName: VPXC0581E101MVTM
csi = Header 8X2: 8*2P接插件; 版权归属: 封装库来自淘宝 ID：黄晶宝石; BOM名称: 8*2P接插件; 学习资源: https://shop463601444.taobao.com
D1 = BZT52C16: BOM_Manufacturer: Shandong Jingdao Microelectronics; Contributor: LCSC; BOM_Supplier: LCSC; BOM_Supplier Part: C353554; BOM_Manufacturer Part: BZT52C16; BOM_JLCPCB Part Class: Extended Part; spicePre: D; spiceSymbolName: BZT52C16_C353554
D2 = SS54: BOM_Manufacturer: Slkor(SLKORMICRO Elec.); Contributor: LCSC; BOM_Supplier: LCSC; BOM_Supplier Part: C513478; BOM_Manufacturer Part: SS54; BOM_JLCPCB Part Class: Extended Part; spicePre: D; spiceSymbolName: SS54_C513478
D3 D4 D7 D8 Ddct Dsa1-Dsa5 = 1N5819W_C727115: BOM_Manufacturer: TWGMC; Contributor: LCSC; BOM_Supplier: LCSC; BOM_Supplier Part: C727115; BOM_Manufacturer Part: 1N5819W; BOM_JLCPCB Part Class: Extended Part; spicePre: D; spiceSymbolName: 1N5819W_C727115
D5 D6 = 3V3稳压二极管: BOM_Manufacturer: LGE; Contributor: LCSC; BOM_Supplier: LCSC; BOM_Supplier Part: C545347; BOM_Manufacturer Part: BZT52C3V3; BOM_JLCPCB Part Class: Extended Part; spicePre: D; spiceSymbolName: BZT52C3V3_C545347
JPdct JPsa1-JPsa5 = Header 2: 2P接插件; 版权归属: 源创客; BOM名称: 2P接插件; 学习资源: www.ooocke.com
K1-K4 = M3: 铜柱孔; 版权归属: 源创客; BOM名称: 铜柱孔; 学习资源: www.ooocke.com
L1 = 电感
LED1-LED3 = LED-5MM: 5mm插件LED; 版权归属: 源创客; BOM名称: 5mm插件LED; 学习资源: www.ooocke.com
LED4-LED7 = D-G060306G1-KS2: BOM_Manufacturer: Wuxi ARK Tech Elec; Contributor: LCSC; BOM_Supplier: LCSC; BOM_Supplier Part: C118334; BOM_Manufacturer Part: D-G060306G1-KS2; BOM_JLCPCB Part Class: Extended Part; spicePre: L; spiceSymbolName: D-G060306G1-KS2
P1 = Header 8: 8P接插件; 版权归属: 封装库来自淘宝 ID：黄晶宝石; BOM名称: 8P接插件; 学习资源: https://shop463601444.taobao.com
P2 = Header 8: 屏幕; BOM名称: 8P接插件; 版权归属: 封装库来自淘宝 ID：黄晶宝石; 学习资源: https://shop463601444.taobao.com
P3 = 无线串口模块
P16 P17 P20 P21 = KF301-5.0-2P: BOM_Manufacturer: Cixi Kefa Elec; Contributor: LCSC; BOM_Supplier: LCSC; BOM_Supplier Part: C474881; BOM_Manufacturer Part: KF301-5.0-2P; BOM_JLCPCB Part Class: Extended Part; spicePre: U; spiceSymbolName: KF301-5.0-2P
Q1 = mos管: HY19P03 P-Channel MOSFET
Q2 = 三极管: 三极管NPN型 蜂鸣器  S8050; BOM名称: 高频放大-NPN型; 版权归属: 封装库来自淘宝 ID：黄晶宝石; 属性: 40V 1.5A 1W 100MHZ; 技术支持，联系售后: https://shop463601444.taobao.com
Q3-Q18 = TPH1R403NL: BOM_Manufacturer: TOSHIBA; BOM_Supplier: LCSC; BOM_Manufacturer Part: TPH1R403NL; BOM_Supplier Part: C83440; BOM_JLCPCB Part Class: Extended Part; spicePre: Q; spiceSymbolName: TPH1R403NL
Qdct Qsa1-Qsa5 = AO3402: Manufacturer: AOS; Symbol: AO3402_C14385; Add into BOM: yes; Drain Source Voltage (Vdss): 30V; Continuous Drain Current (Id): 4A; Power Dissipation (Pd): 1.4W; Drain Source On Resistance (RDS(on)@Vgs,Id): 55mΩ@10V,4A; Gate Threshold Voltage (Vgs(th)@Id): 1.4V@250uA; Total Gate Charge (Qg@Vgs): 4.34nC@4.5V; Input Capacitance (Ciss@Vds): 390pF@15V; Name: AO3402; Device: AO3402; LCSC Part Name: N沟道 30V 4A; Supplier Part: C14385; Manufacturer Part: AO3402; Supplier Footprint: SOT-23; JLCPCB Part Class: Extended Part; Datasheet: https://atta.szlcsc.com/upload/public/pdf/source/20171023/C14385_15087455190191052858.pdf; Supplier: LCSC; Convert to PCB: yes; Type: N沟道; Operating Temperature: -55℃~+150℃@(Tj)
R1-R5 R7 R8 = R: 0603
R6 = R: 100R 均用 0603
R9-R23 R25-R28 RCSI Rdct1 Rdct2 Rsa11 Rsa12 Rsa21 Rsa22 Rsa31 Rsa32 Rsa41 Rsa42 Rsa51 Rsa52 = R
R29-R42 = 100K: BOM_Manufacturer: YAGEO; BOM_Manufacturer Part: RC0603JR-07100KL; nameAlias: Resistance (Ohms); Contributor: LCSC; BOM_Supplier: LCSC; BOM_Supplier Part: C100048; BOM_JLCPCB Part Class: Extended Part; spicePre: R; spiceSymbolName: RC0603JR-07100KL
receive_UART3 wifi_uart3 = Header 4X2: 4*2P接插件; 版权归属: 封装库来自淘宝 ID：黄晶宝石; BOM名称: 4*2P接插件; 学习资源: https://shop463601444.taobao.com
S1 = 编码开关: 2路编码开关; 版权归属: 源创客; BOM名称: 2路编码开关; 学习资源: www.ooocke.com
S3-S5 = 轻触开关: 2脚直插6x6轻触开关; BOM名称: 2脚轻触开关; 版权归属: 源创客; 学习资源: www.ooocke.com
S6 = 单刀双置开关: BOM名称: MTS10x系列3脚扭子开关; 版权归属: 源创客; 学习资源: www.ooocke.com
S7 S9 = SS-12D10L5: BOM_Manufacturer: XKB Enterprise; Contributor: LCSC; BOM_Supplier: LCSC; BOM_Supplier Part: C319012; BOM_Manufacturer Part: SS-12D10L5; BOM_JLCPCB Part Class: Extended Part; spicePre: S; spiceSymbolName: SS-12D10L5
send_UART4 Servo_1-Servo_3 = Header 3: 3P接插件; 版权归属: 封装库来自淘宝 ID：黄晶宝石; BOM名称: 3P接插件; 学习资源: https://shop463601444.taobao.com
U1 = SCT2450: BOM_Manufacturer: SCT(芯洲科技); BOM_Manufacturer Part: SCT2450CSTER; Contributor: LCSC; BOM_Supplier: LCSC; BOM_Supplier Part: C2830168; BOM_JLCPCB Part Class: Extended Part; spicePre: U; spiceSymbolName: SCT2450CSTER
U2 U2add = RT9013-33: BOM_Manufacturer: RICHTEK; BOM_Manufacturer Part: RT9013-33GB; BOM_Supplier: LCSC; BOM_Supplier Part: C47773; BOM_JLCPCB Part Class: Extended Part; spicePre: U; spiceSymbolName: RT9013-33GB
U3 = RY2121: BOM_Manufacturer: RYCHiP(蕊源); Contributor: LCSC; BOM_Supplier: LCSC; BOM_Supplier Part: C2887853; BOM_Manufacturer Part: RY2121; spicePre: U; spiceSymbolName: RY2121
U4 U5 U7 U8 = DRV8701ERGER: BOM_Manufacturer: Texas Instruments; Contributor: LCSC; BOM_Supplier: LCSC; BOM_Supplier Part: C90964; BOM_Manufacturer Part: DRV8701ERGER; BOM_JLCPCB Part Class: Extended Part; spicePre: U; spiceSymbolName: DRV8701ERGER
U6 U9 = SN74HC125PWR: BOM_Manufacturer: Texas Instruments; Contributor: LCSC; BOM_Supplier: LCSC; BOM_Supplier Part: C132994; BOM_Manufacturer Part: SN74HC125PWR; BOM_JLCPCB Part Class: Extended Part; spicePre: U; spiceSymbolName: SN74HC125PWR
U10 = MIMXRT1064xVL_CoreBoard: 逐飞科技i.MX RT1064核心板整体原理，可直接使用
uart1 = UART1
uart3 uart4 = UART4
uart5 = PZ254V-11-04P: Manufacturer: XFCN(兴飞); Symbol: PZ254V-11-04P_C2691448; Add into BOM: yes; Pitch: 2.54mm; Pin Structure: 1x4P; Circluar Pins/Square Pins: 方针; Current Rating (Max): 3A; Voltage Rating (Max): 250V; Name: PZ254V-11-04P; Device: PZ254V-11-04P; LCSC Part Name: 2.54mm 1x4P 直插 方针; Supplier Part: C2691448; Manufacturer Part: PZ254V-11-04P; Supplier Footprint: 插件,P=2.54mm; JLCPCB Part Class: Extended Part; Datasheet: https://atta.szlcsc.com/upload/public/pdf/source/20200309/C492403_F9F19131791D08044AD4F84F8E751A34.pdf; Supplier: LCSC; Convert to PCB: yes; Number of Rows: 单排; Number of Pins: 4P; Row Spacing: -; Mounting Type: 直插; Length of Mating Pin: 6mm; Insulation Height: 2.5mm; Length of End Connection Pin: 3mm; Contact Material: -; Operating Temperature Range: -40℃~+105℃; Color: 黑色
UCSI = RT9013-33: BOM_Manufacturer: RICHTEK; BOM_Supplier: LCSC; BOM_Manufacturer Part: RT9013-33GB; BOM_Supplier Part: C47773; BOM_JLCPCB Part Class: Extended Part; spicePre: U; spiceSymbolName: RT9013-33GB